# EAGLE design buttonboard-center (EAGLE 6.6.0)
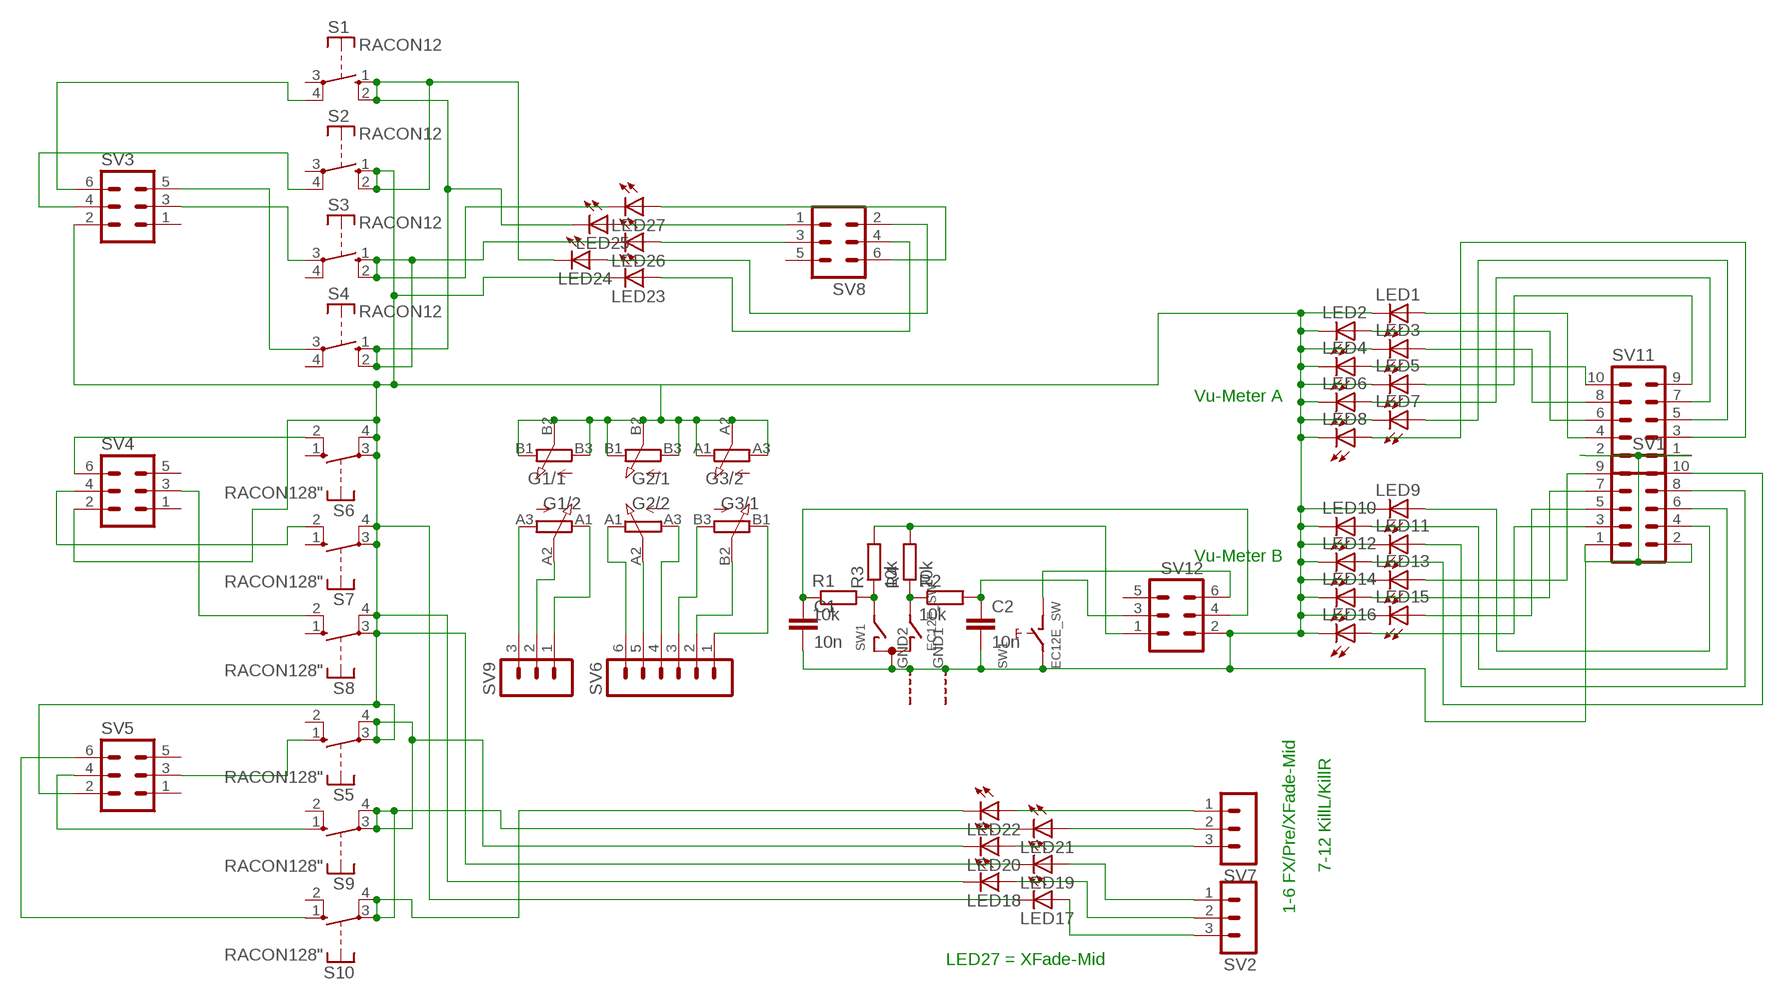
[diagram p0: schematic, sheet 1]

## Parts
C1  10n  C-EU025-025X050  [C025-025X050]
C2  10n  C-EU025-025X050  [C025-025X050]
G1  RS60112RS  [RS60112]
G2  RS60112RS  [RS60112]
G3  RS60112RS  [RS60112]
LED1  LED3MM  [LED3MM]
LED2  LED3MM  [LED3MM]
LED3  LED3MM  [LED3MM]
LED4  LED3MM  [LED3MM]
LED5  LED3MM  [LED3MM]
LED6  LED3MM  [LED3MM]
LED7  LED3MM  [LED3MM]
LED8  LED3MM  [LED3MM]
LED9  LED3MM  [LED3MM]
LED10  LED3MM  [LED3MM]
LED11  LED3MM  [LED3MM]
LED12  LED3MM  [LED3MM]
LED13  LED3MM  [LED3MM]
LED14  LED3MM  [LED3MM]
LED15  LED3MM  [LED3MM]
LED16  LED3MM  [LED3MM]
LED17  LED3MM  [LED3MM]
LED18  LED3MM  [LED3MM]
LED19  LED3MM  [LED3MM]
LED20  LED3MM  [LED3MM]
LED21  LED3MM  [LED3MM]
LED22  LED3MM  [LED3MM]
LED23  LED3MM  [LED3MM]
LED24  LED3MM  [LED3MM]
LED25  LED3MM  [LED3MM]
LED26  LED3MM  [LED3MM]
LED27  LED3MM  [LED3MM]
R1  10k  R-EU_0207/7  [0207/7]
R2  10k  R-EU_0207/7  [0207/7]
R3  10k  R-EU_0207/7  [0207/7]
R4  10k  R-EU_0207/7  [0207/7]
S1  RACON12  [RACON12]
S2  RACON12  [RACON12]
S3  RACON12  [RACON12]
S4  RACON12  [RACON12]
S5  RACON128"  [RACON8]
S6  RACON128"  [RACON8]
S7  RACON128"  [RACON8]
S8  RACON128"  [RACON8]
S9  RACON128"  [RACON8]
S10  RACON128"  [RACON8]
SV1  MA05-2  [MA05-2]
SV2  MA03-1  [MA03-1]
SV3  MA03-2  [MA03-2]
SV4  MA03-2  [MA03-2]
SV5  MA03-2  [MA03-2]
SV6  MA06-1  [MA06-1]
SV7  MA03-1  [MA03-1]
SV8  MA03-2  [MA03-2]
SV9  MA03-1  [MA03-1]
SV11  MA05-2  [MA05-2]
SV12  MA03-2  [MA03-2]
SW1  EC12E_SW  [ALPS_EC12E_SW]

## Nets
GND: C1.2 C2.2 G1.B1(/2:E) G1.B2(/2:S) G1.B3(/2:A) G2.B1(/2:E) G2.B2(/2:S) G2.B3(/2:A) G3.A1(/1:E) G3.A2(/1:S) G3.A3(/1:A) LED1.K(C) LED2.K(C) LED3.K(C) LED4.K(C) LED5.K(C) LED6.K(C) LED7.K(C) LED8.K(C) LED9.K(C) LED10.K(C) LED11.K(C) LED12.K(C) LED13.K(C) LED14.K(C) LED15.K(C) LED16.K(C) LED17.K(C) LED18.K(C) LED19.K(C) LED20.K(C) LED21.K(C) LED22.K(C) LED23.K(C) LED24.K(C) LED25.K(C) LED26.K(C) LED27.K(C) S1.1(S) S1.2(S) S2.1(S) S2.2(S) S3.1(S) S3.2(S) S4.1(S) S4.2(S) S5.3(P) S5.4(P) S6.3(P) S6.4(P) S7.3(P) S7.4(P) S8.3(P) S8.4(P) S9.3(P) S9.4(P) S10.3(P) S10.4(P) SV1.1 SV1.2 SV3.2 SV4.2 SV5.2 SV11.1 SV11.2 SV12.2 SW1.C SW1.E SW1.GND1(G) SW1.GND2(G)
N$1: R1.2 R3.1 SW1.A
N$2: LED16.A SV1.3
N$3: LED15.A SV1.5
N$4: LED14.A SV1.7
N$5: LED13.A SV1.9
N$6: LED12.A SV1.10
N$7: LED11.A SV1.8
N$8: LED10.A SV1.6
N$9: LED9.A SV1.4
N$10: LED8.A SV11.3
N$11: LED7.A SV11.5
N$12: LED6.A SV11.7
N$13: LED5.A SV11.9
N$14: LED4.A SV11.10
N$15: LED3.A SV11.8
N$16: R2.1 R4.1 SW1.B
N$17: C1.1 R1.1 SV12.4
N$18: LED2.A SV11.6
N$19: LED1.A SV11.4
N$20: LED17.A SV2.3
N$21: LED18.A SV2.2
N$22: LED19.A SV2.1
N$23: LED20.A SV7.3
N$24: LED21.A SV7.2
N$25: LED22.A SV7.1
N$26: LED24.A SV8.2
N$27: SV12.6 SW1.D
N$28: LED25.A SV8.1
N$29: S3.3(P) SV3.3
N$30: LED23.A SV8.4
N$31: S2.4(P) SV3.4
N$32: S1.4(P) SV3.6
N$33: C2.1 R2.2 SV12.3
N$34: R3.2 R4.2 SV12.1
N$35: LED26.A SV8.3
N$36: S6.2(S) SV4.6
N$37: LED27.A SV8.6
N$38: S4.3(P) SV3.5
N$40: S5.1(S) SV5.3
N$41: G1.A3(/1:A) SV9.3
N$42: G1.A2(/1:S) SV9.2
N$43: G1.A1(/1:E) SV9.1
N$44: G2.A1(/1:E) SV6.6
N$45: G2.A2(/1:S) SV6.5
N$46: G2.A3(/1:A) SV6.4
N$47: G3.B3(/2:A) SV6.3
N$48: G3.B2(/2:S) SV6.2
N$49: G3.B1(/2:E) SV6.1
N$50: S9.1(S) SV5.4
N$51: S7.2(S) SV4.4
N$52: S8.2(S) SV4.3
N$56: S10.1(S) SV5.6
Unconnected: S1.3(P) S2.3(P) S3.4(P) S4.4(P) S5.2(S) S6.1(S) S7.1(S) S8.1(S) S9.2(S) S10.2(S) SV3.1 SV4.1 SV4.5 SV5.1 SV5.5 SV8.5 SV12.5

## Notes on the sheet
- Vu-Meter A
- Vu-Meter B
- 1-6 FX/Pre/XFade-Mid
- 7-12 KillL/KillR
- LED27 = XFade-Mid

## Library data of the parts
C1 C2 = resistor:C-EU: CAPACITOR, European symbol
G1-G3 = pot-fabimod:RS60112
LED1-LED27 = led:LED: LED OSRAM: - CHIPLED LG R971, LG N971, LY N971, LG Q971, LY Q971, LO R971, LY R971 LH N974, LH R974 LS Q976, LO Q976, LY Q976 LO Q996 - Hyper CHIPLED LW Q18S LB Q993, LB Q99A, LB R99A - SideLED LS A670, LO A670, LY A670, LG A670, LP A670 LB A673, LV A673, LT A673, LW A673 LH A674 LY A675 LS A676, LA A676, LO A676, LY A676, LW A676 LS A679, LY A679, LG A679 - Hyper Micro SIDELED® LS Y876, LA Y876, LO Y876, LY Y876 LT Y87S - SmartLED LW L88C, LW L88S LB L89C, LB L89S, LG L890 LS L89K, LO L89K, LY L89K LS L896, LA L896, LO L896, LY L896 - TOPLED LS T670, LO T670, LY T670, LG T670, LP T670 LSG T670, LSP T670, LSY T670, LOP T670, LYG T670 LG T671, LOG T671, LSG T671 LB T673, LV T673, LT T673, LW T673 LH T674 LS T676, LA T676, LO T676, LY T676, LB T676, LH T676, LSB T676, LW T676 LB T67C, LV T67C, LT T67C, LS T67K, LO T67K, LY T67K, LW E67C LS E67B, LA E67B, LO E67B, LY E67B, LB E67C, LV E67C, LT E67C LW T67C LS T679, LY T679, LG T679 LS T770, LO T770, LY T770, LG T770, LP T770 LB T773, LV T773, LT T773, LW T773 LH T774 LS E675, LA E675, LY E675, LS T675 LS T776, LA T776, LO T776, LY T776, LB T776 LHGB T686 LT T68C, LB T68C - Hyper Mini TOPLED® LB M676 - Mini TOPLED Santana® LG M470 LS M47K, LO M47K, LY M47K Source: http://www.osram.convergy.de LUXEON: - LUMILED® LXK2-PW12-R00, LXK2-PW12-S00, LXK2-PW14-U00, LXK2-PW14-V00 LXK2-PM12-R00, LXK2-PM12-S00, LXK2-PM14-U00 LXK2-PE12-Q00, LXK2-PE12-R00, LXK2-PE12-S00, LXK2-PE14-T00, LXK2-PE14-U00 LXK2-PB12-K00, LXK2-PB12-L00, LXK2-PB12-M00, LXK2-PB14-N00, LXK2-PB14-P00, LXK2-PB14-Q00 LXK2-PR12-L00, LXK2-PR12-M00, LXK2-PR14-Q00, LXK2-PR14-R00 LXK2-PD12-Q00, LXK2-PD12-R00, LXK2-PD12-S00 LXK2-PH12-R00, LXK2-PH12-S00 LXK2-PL12-P00, LXK2-PL12-Q00, LXK2-PL12-R00 Source: www.luxeon.com KINGBRIGHT: KA-3528ASYC Source: www.kingbright.com
R1-R4 = resistor:R-EU_: RESISTOR, European symbol
S1-S10 = switch-misc:RACON12: ITT SWITCH
SV1 SV11 = con-lstb:MA05-2: PIN HEADER; OC_FARNELL: unknown; OC_NEWARK: unknown
SV2 SV7 SV9 = con-lstb:MA03-1: PIN HEADER; OC_FARNELL: unknown; OC_NEWARK: unknown
SV3-SV5 SV8 SV12 = con-lstb:MA03-2: PIN HEADER; OC_FARNELL: unknown; OC_NEWARK: unknown
SV6 = con-lstb:MA06-1: PIN HEADER; OC_FARNELL: unknown; OC_NEWARK: unknown
SW1 = switch-alps:EC12E_SW: ALPS rotary Encoder EC12E series with switch; MPN: EC12E2424407; OC_FARNELL: 1520813; OC_NEWARK: 74M1068

## Board
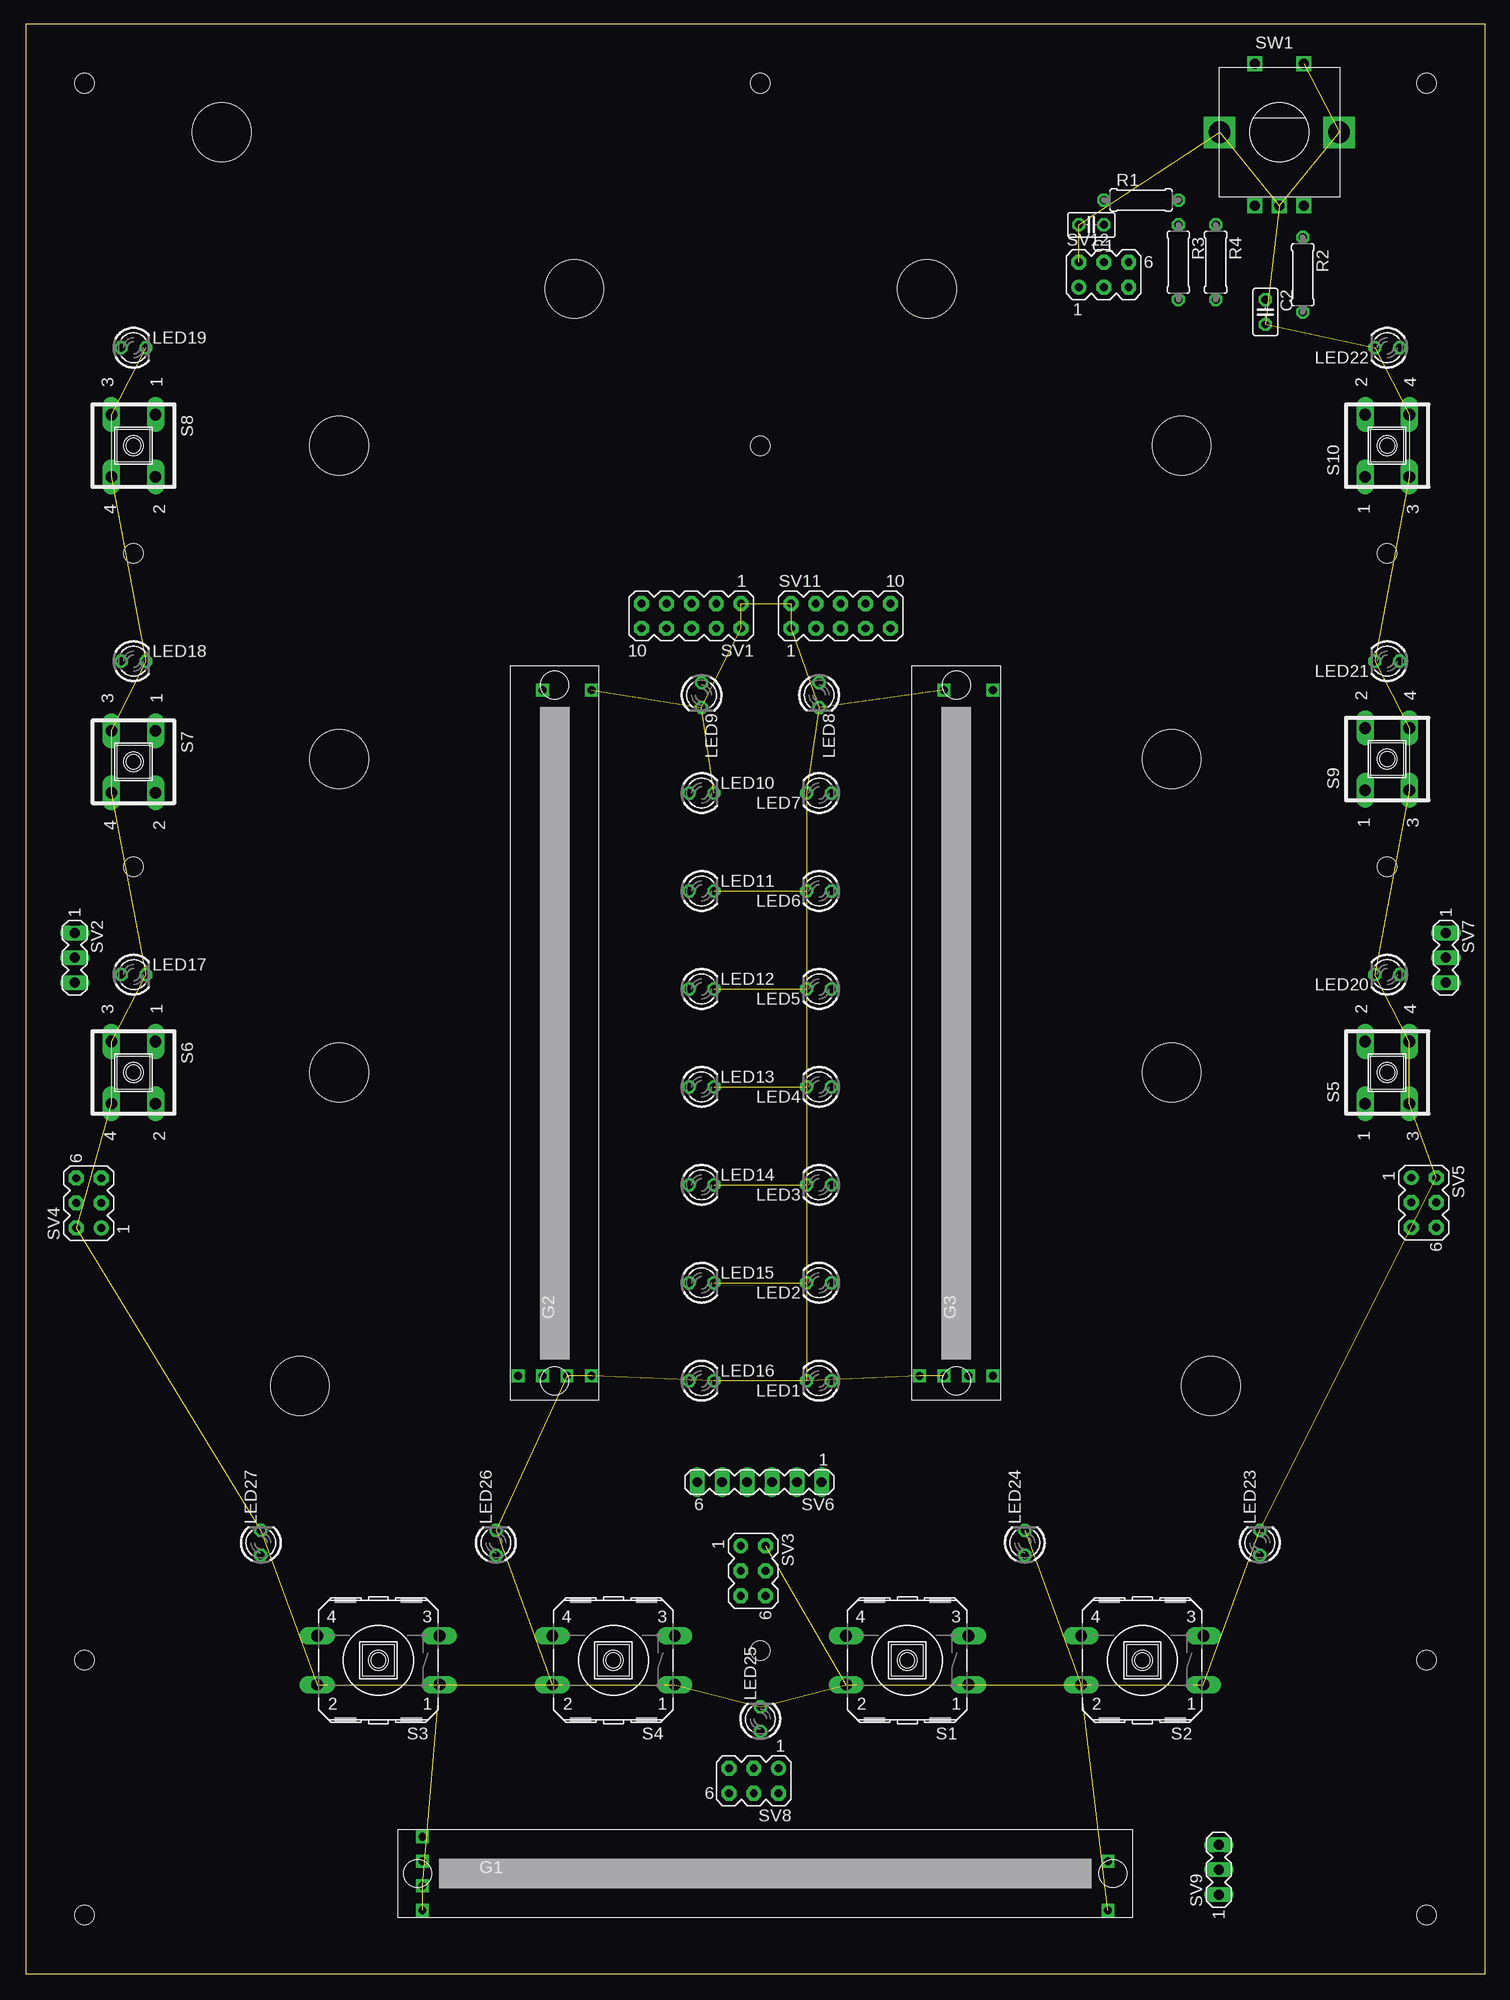
[diagram p1: board, top side]
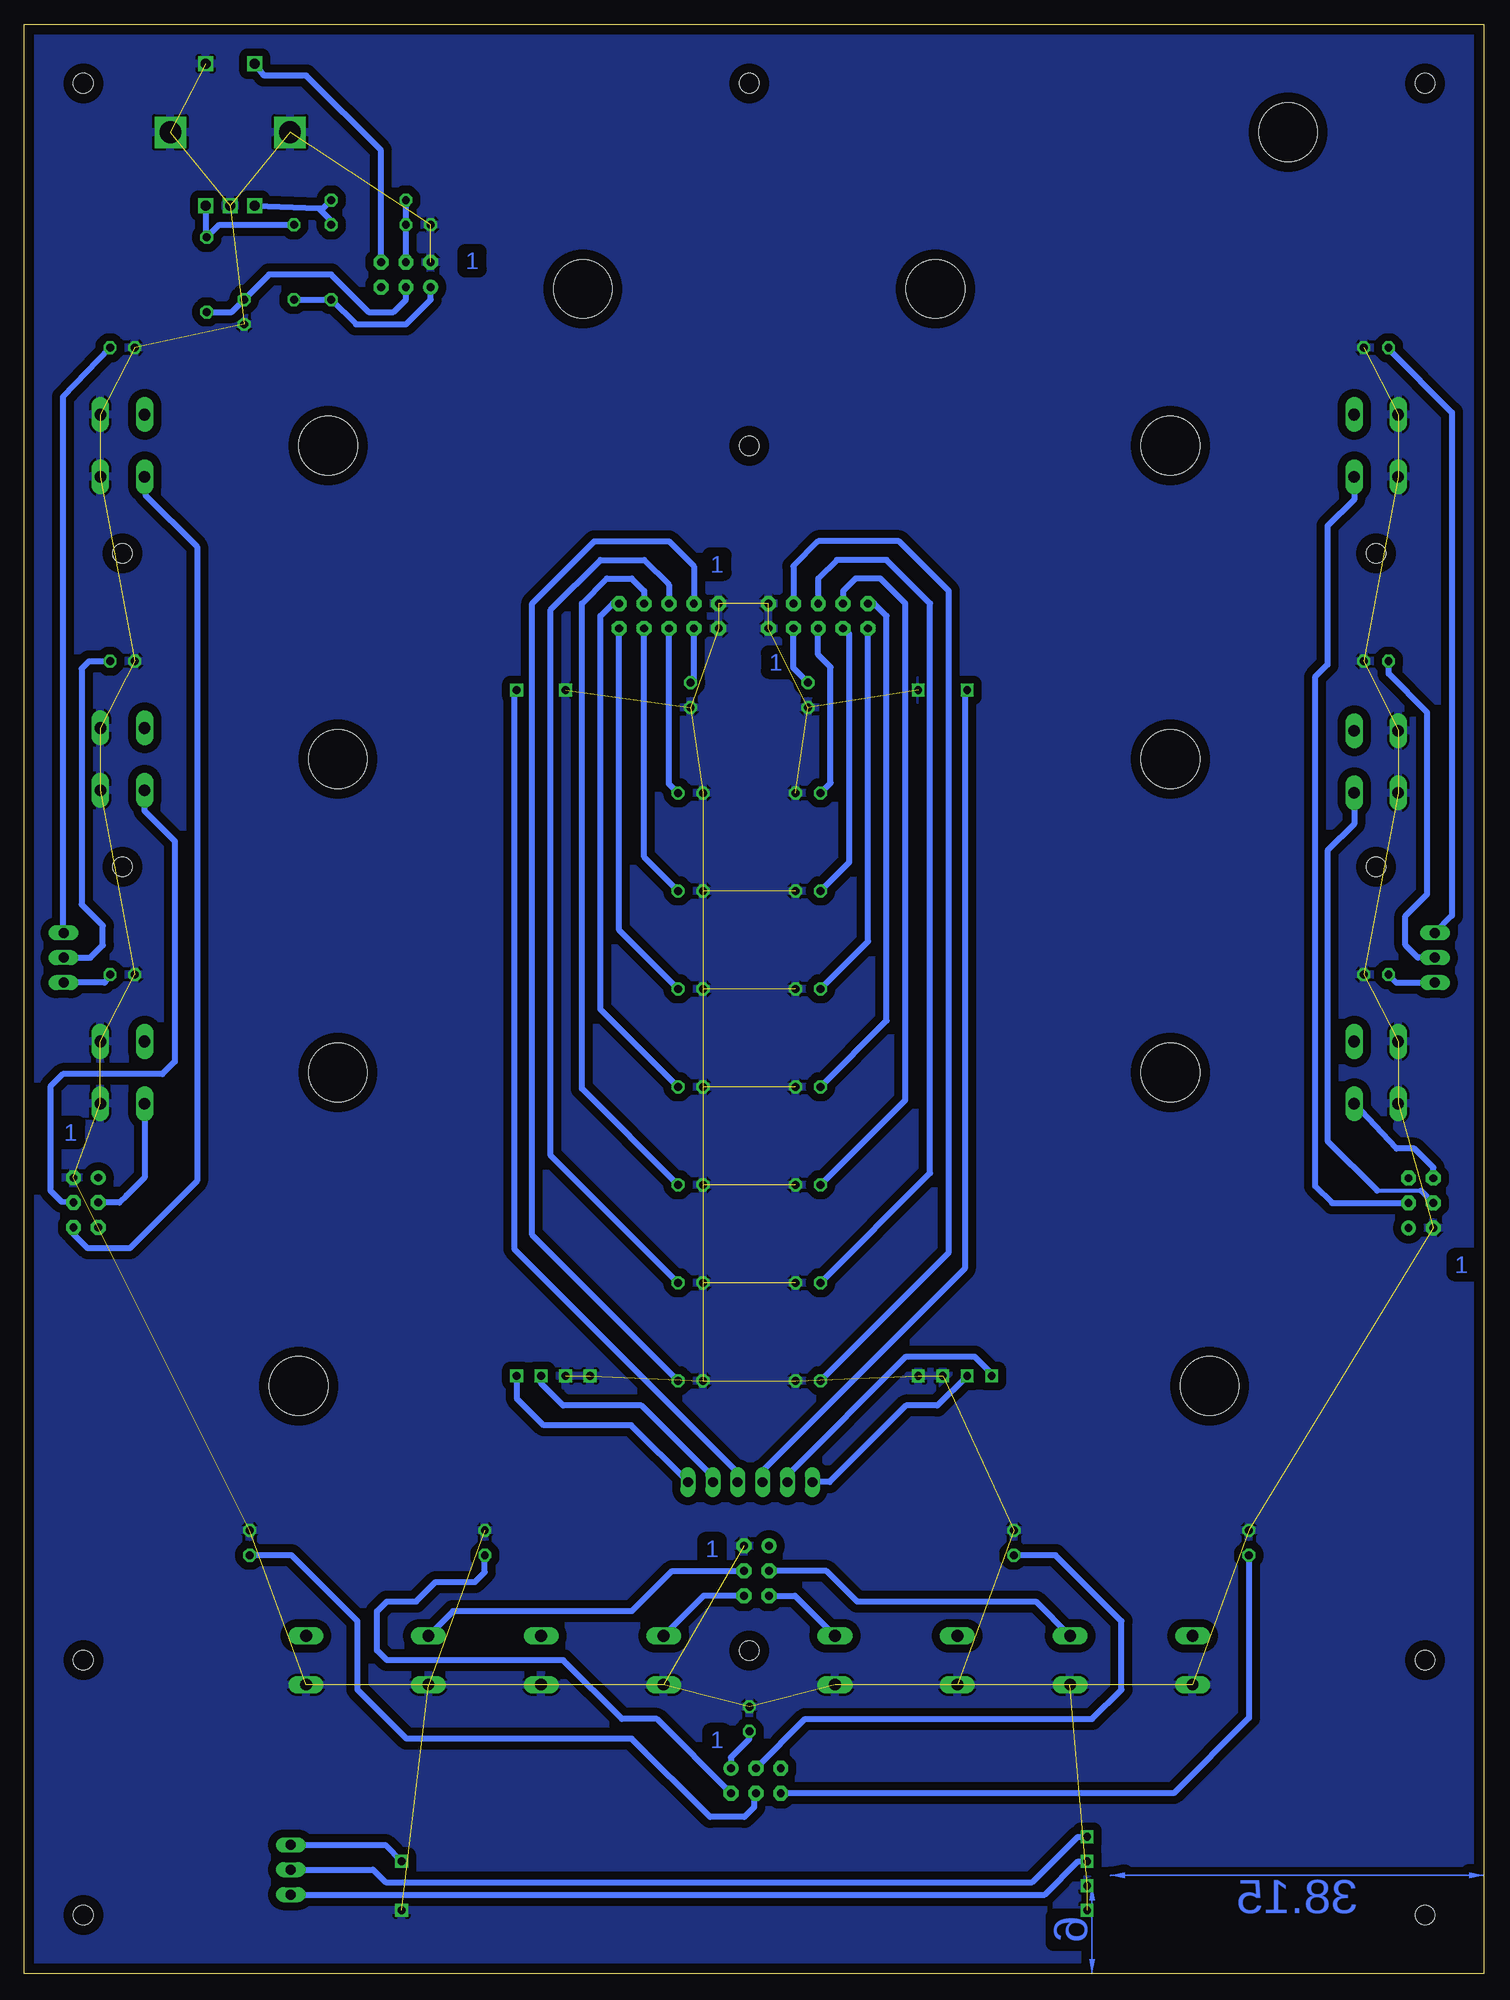
[diagram p2: board, bottom side, seen from below]

Size 149 x 199 mm. Coordinates in mm from the lower left corner, seen from the top.
Outline: 0,0 149,0 149,199 0,199 0,0
Copper layers (1*16): Top 0.035mm / dielectric 1.5mm / Bottom 0.035mm
Design rules "default": minimum track width 10mil, minimum drill 24mil, track to track 8mil, track to pad 8mil, pad to pad 8mil, via to via 8mil, smd to smd 8mil, copper to edge 40mil, drill to drill 8mil, minimum pad ring 10mil, minimum via ring 8mil, stop-mask expansion 4mil, vias tented up to drill 0mil, thermal gap 10mil
Holes 6 mm at 28,60 32,92 117,124 32,156 118,156 117,92 121,60 32,124 20,188 92,172 56,172
Holes 2 mm at 6,193 143,193 75,193 75,156 143,6 6,6 6,32 143,32 139,113 139,145 11,113 11,145 75,33

### Footprints (pad centres in the part's own frame; a part is rotated, then mirrored left to right if it is on the bottom)
C025-025X050 = drill 0.813 octagon: 1 -1.27,0; 2 1.27,0
RS60112 = drill 0.8 square: A1 -35,1.25; A2 -35,3.75; A3 35,1.25; B1 -35,-3.75; B2 -35,-1.25; B3 35,-3.75
LED3MM = drill 0.813 octagon: A -1.27,0; K 1.27,0
0207/7 = drill 0.813 octagon: 1 -3.81,0; 2 3.81,0
RACON12 = drill 1.194 long: 1 -6.248,2.489; 2 6.248,2.489; 3 -6.248,-2.489; 4 6.248,-2.489
RACON8 = drill 1.194 long: 1 -3.175,2.25; 2 3.175,2.25; 3 -3.175,-2.25; 4 3.175,-2.25
MA05-2 = drill 0.8 pad 1.524 octagon: 1 -5.08,-1.27; 2 -5.08,1.27; 3 -2.54,-1.27; 4 -2.54,1.27; 5 0,-1.27; 6 0,1.27; 7 2.54,-1.27; 8 2.54,1.27; 9 5.08,-1.27; 10 5.08,1.27
MA03-1 = drill 1.016 long: 1 -2.54,0; 2 0,0; 3 2.54,0
MA03-2 = drill 0.8 pad 1.524: 1 -2.54,-1.27 | drill 0.8 pad 1.524 octagon: 2 -2.54,1.27; 3 0,-1.27; 4 0,1.27; 5 2.54,-1.27; 6 2.54,1.27
MA06-1 = drill 1.016 long: 1 -6.35,0; 2 -3.81,0; 3 -1.27,0; 4 1.27,0; 5 3.81,0; 6 6.35,0
ALPS_EC12E_SW = drill 1 square: A -2.5,-7.5; B 2.5,-7.5; C 0,-7.5; D -2.5,7; E 2.5,7 | drill 2.2 square: GND1 -6.1,0; GND2 6.1,0

### Placement (x,y rotation side)
C1  108.79,178.54 180 top
C2  126.57,169.65 270 top
G1  75.5,10.23 0 top
G2  54,96.04 90 top
G3  95,96.04 90 top
LED1  81,60.54 180 top
LED2  81,70.54 180 top
LED3  81,80.54 180 top
LED4  81,90.54 180 top
LED5  81,100.54 180 top
LED6  81,110.54 180 top
LED7  81,120.54 180 top
LED8  81,130.54 270 top
LED9  69,130.54 270 top
LED10  69,120.54 0 top
LED11  69,110.54 0 top
LED12  69,100.54 0 top
LED13  69,90.54 0 top
LED14  69,80.54 0 top
LED15  69,70.54 0 top
LED16  69,60.54 0 top
LED17  11,102 0 top
LED18  11,134 0 top
LED19  11,166 0 top
LED20  139,102 180 top
LED21  139,134 180 top
LED22  139,166 180 top
LED23  126,44 90 top
LED24  102,44 90 top
LED25  75,26 90 top
LED26  48,44 90 top
LED27  24,44 90 top
R1  113.87,181.08 0 top
R2  130.38,173.46 270 top
R3  117.68,174.73 270 top
R4  121.49,174.73 270 top
S1  90,32 180 top
S2  114,32 180 top
S3  36,32 180 top
S4  60,32 180 top
S5  139,92 90 top
S6  11,92 270 top
S7  11,123.73 270 top
S8  11,156 270 top
S9  139,124 90 top
S10  139,156 90 top
SV1  67.96,138.62 180 top
SV2  5,103.73 270 top
SV3  74.27,41.13 270 top
SV4  6.42,78.68 90 top
SV5  142.73,78.73 270 top
SV6  74.91,50.19 180 top
SV7  145,103.73 270 top
SV8  74.33,19.7 180 top
SV9  121.81,10.62 90 top
SV11  83.2,138.62 0 top
SV12  110.06,173.46 0 top
SW1  128,188 0 top

### Tracks (layer width: path | path; a pad name or v marks a point on that pad's centre or on a via)
GND  (69 unrouted)
  pour Bottom (isolate 0.813): -1,201 151,201 151,-1 -1,-1
N$1
  Bottom 0.61: SW1.A 118.95,180.23 | 118.95,180.23 118.53,180.23 R1.2 | R3.1 117.68,178.96 118.95,180.23
N$2
  Bottom 0.61: LED16.A 54.62,73.64 54.62,141.16 59.7,146.24 67.96,146.24 70.5,143.7 SV1.3
N$3
  Bottom 0.61: LED15.A 56.53,81.74 56.53,139.89 60.98,144.34 66.06,144.34 67.96,142.43 SV1.5
N$4
  Bottom 0.61: LED14.A 59.07,89.2 59.07,139.89 61.61,142.43 64.15,142.43 65.42,141.16 SV1.7
N$5
  Bottom 0.61: LED13.A 60.98,97.3 60.98,138.62 62.24,139.89 SV1.9
N$6
  Bottom 0.61: LED12.A 62.88,105.39 SV1.10
N$7
  Bottom 0.61: LED11.A 64.78,113.48 64.78,136.81 65.42,137.44 SV1.8
N$8
  Bottom 0.61: LED10.A 66.69,121.58 66.69,133.38 67.96,134.65 SV1.6
N$9
  Bottom 0.61: LED9.A 70.5,133.31 SV1.4
N$10
  Bottom 0.61: LED8.A 80.66,132.15 SV11.3
N$11
  Bottom 0.61: LED7.A 83.2,121.47 SV11.5
N$12
  Bottom 0.61: LED6.A 85.74,114.01 SV11.7
N$13
  Bottom 0.61: LED5.A 88.28,106.55 SV11.9
N$14
  Bottom 0.61: LED4.A 90.19,98.45 90.19,138.62 88.92,139.89 SV11.10
N$15
  Bottom 0.61: LED3.A 92.09,90.36 92.09,139.89 89.55,142.43 87.01,142.43 85.74,141.16 SV11.8
N$16
  Bottom 0.61: SW1.B 130.5,177.39 R2.1 129.11,178.54 R4.1
N$17
  Bottom 0.61: SV12.4 C1.1 R1.1
N$18
  Bottom 0.61: LED2.A 95.27,83.53 95.27,139.25 90.19,144.34 85.74,144.34 83.2,141.79 SV11.6
N$19
  Bottom 0.61: LED1.A 97.17,75.44 97.17,139.89 90.82,146.24 83.2,146.24 80.66,143.7 SV11.4
N$20
  Bottom 0.61: LED17.A 8.92,101.19 SV2.3
N$21
  Bottom 0.61: LED18.A 9.73,132.71 5.81,128.79 5.81,110.19 8,108 8,105 6.73,103.73 SV2.2
N$22
  Bottom 0.61: SV2.1 3.27,108.02 3.27,159.38 9.73,165.84 LED19.A
N$23
  Bottom 0.61: LED20.A 140.81,101.19 SV7.3
N$24
  Bottom 0.61: LED21.A 142.41,134 143.18,133.24 143.18,109.17 141,107 141,105 142.27,103.73 SV7.2
N$25
  Bottom 0.61: LED22.A 145.08,160.97 145.08,106.35 SV7.1
N$26
  Bottom 0.61: SV8.2 84.44,26 88,26 94,32 112,32 113,33 113,37 112,38 109,38 107,40 103,40 102,41 LED24.A
N$27
  Bottom 0.61: SV12.6 112.6,186.16 120.22,193.78 124.55,193.78 SW1.D
N$28
  Bottom 0.61: SV8.1 76.87,22.09 75,23.96 LED25.A
N$29
  Bottom 0.61: SV3.3 67.13,41.13 64,38 45.76,38 S3.3
N$30
  Bottom 0.61: SV8.4 74.5,18.26 74.5,17 75.5,16 79,16 87,24 110,24 115,29 115,36 121.73,42.73 LED23.A
N$31
  Bottom 0.61: SV3.4 82.87,41.13 87,37 105.24,37 S2.4
N$32
  Bottom 0.61: SV3.6 79.65,38.59 S1.4
N$33
  Bottom 0.61: R2.2 127.84,169.65 C2.1 124.03,173.46 117.68,173.46 113.87,169.65 111.33,169.65 110.06,170.92 SV12.3
N$34
  Bottom 0.61: R4.2 R3.2 115.14,168.38 110.06,168.38 107.52,170.92 SV12.1
N$35
  Bottom 0.61: SV8.3 69.3,26 40,26 37,29 37,36 43.73,42.73 LED26.A
N$36
  Bottom 0.61: SV4.6 5.15,82.3 7.08,84.23 8.93,84.23 S6.2
N$37
  Bottom 0.61: LED27.A 23.98,26.12 31.67,18.43 SV8.6
N$38
  Bottom 0.61: SV3.5 70.35,38.59 S4.3
N$40
  Bottom 0.61: S5.1 136.75,81.27 138.57,79.47 139.31,78.73 SV5.3
N$41
  Bottom 0.61: SV9.3 112.14,13.16 G1.A3
N$42
  Bottom 0.61: SV9.2 113.41,10.62 112.14,9.35 46.1,9.35 41.47,13.98 G1.A2
N$43
  Bottom 0.61: SV9.1 44.83,8.08 41.43,11.48 G1.A1
N$44
  Bottom 0.61: G2.A1 55.79,58 59,58 66.81,50.19 SV6.6
N$45
  Bottom 0.61: SV6.5 71.1,50.9 59,63 52,63 50.25,61.25 G2.A2
N$46
  Bottom 0.61: G2.A3 53,130.79 53,72 73.64,51.36 SV6.4
N$47
  Bottom 0.61: G3.B3 99,130.79 99,74 76.18,51.18 SV6.3
N$48
  Bottom 0.61: G3.B2 96.25,60.25 94,58 86,58 78.72,50.72 SV6.2
N$49
  Bottom 0.61: G3.B1 98.75,58.75 96,56 87.07,56 SV6.1
N$50
  Bottom 0.61: SV5.4 145.24,78.83 146.35,79.94 146.35,90.58 145.08,91.85 134.92,91.85 133.65,93.12 133.65,115.61 136.75,118.71 S9.1
N$51
  Bottom 0.406: 10.89,79.94 6.41,79.94
  Bottom 0.61: S7.2 13.25,117.36 15.97,114.66 15.97,85.02 10.89,79.94 | 6.41,79.94 SV4.4
N$52
  Bottom 0.254: SV4.3
  Bottom 0.61: S8.2 13.25,150.49 15.97,147.79 15.97,133.63 17.24,132.36 17.24,80.42 15.49,78.67 SV4.3
N$56
  Bottom 0.61: SV5.6 144,75.53 142.54,74.07 138.25,74.07 131.38,80.94 131.38,145.68 136.67,150.97 136.67,152.74 S10.1
(copper drawn outside any net)
  shapes: Bottom area x2

### Text on the board
Bottom: 1 | 1 | 1 | 1 | 1 | 1 | 1